# Altium schematic sheet 更新版.SchDoc
size A3
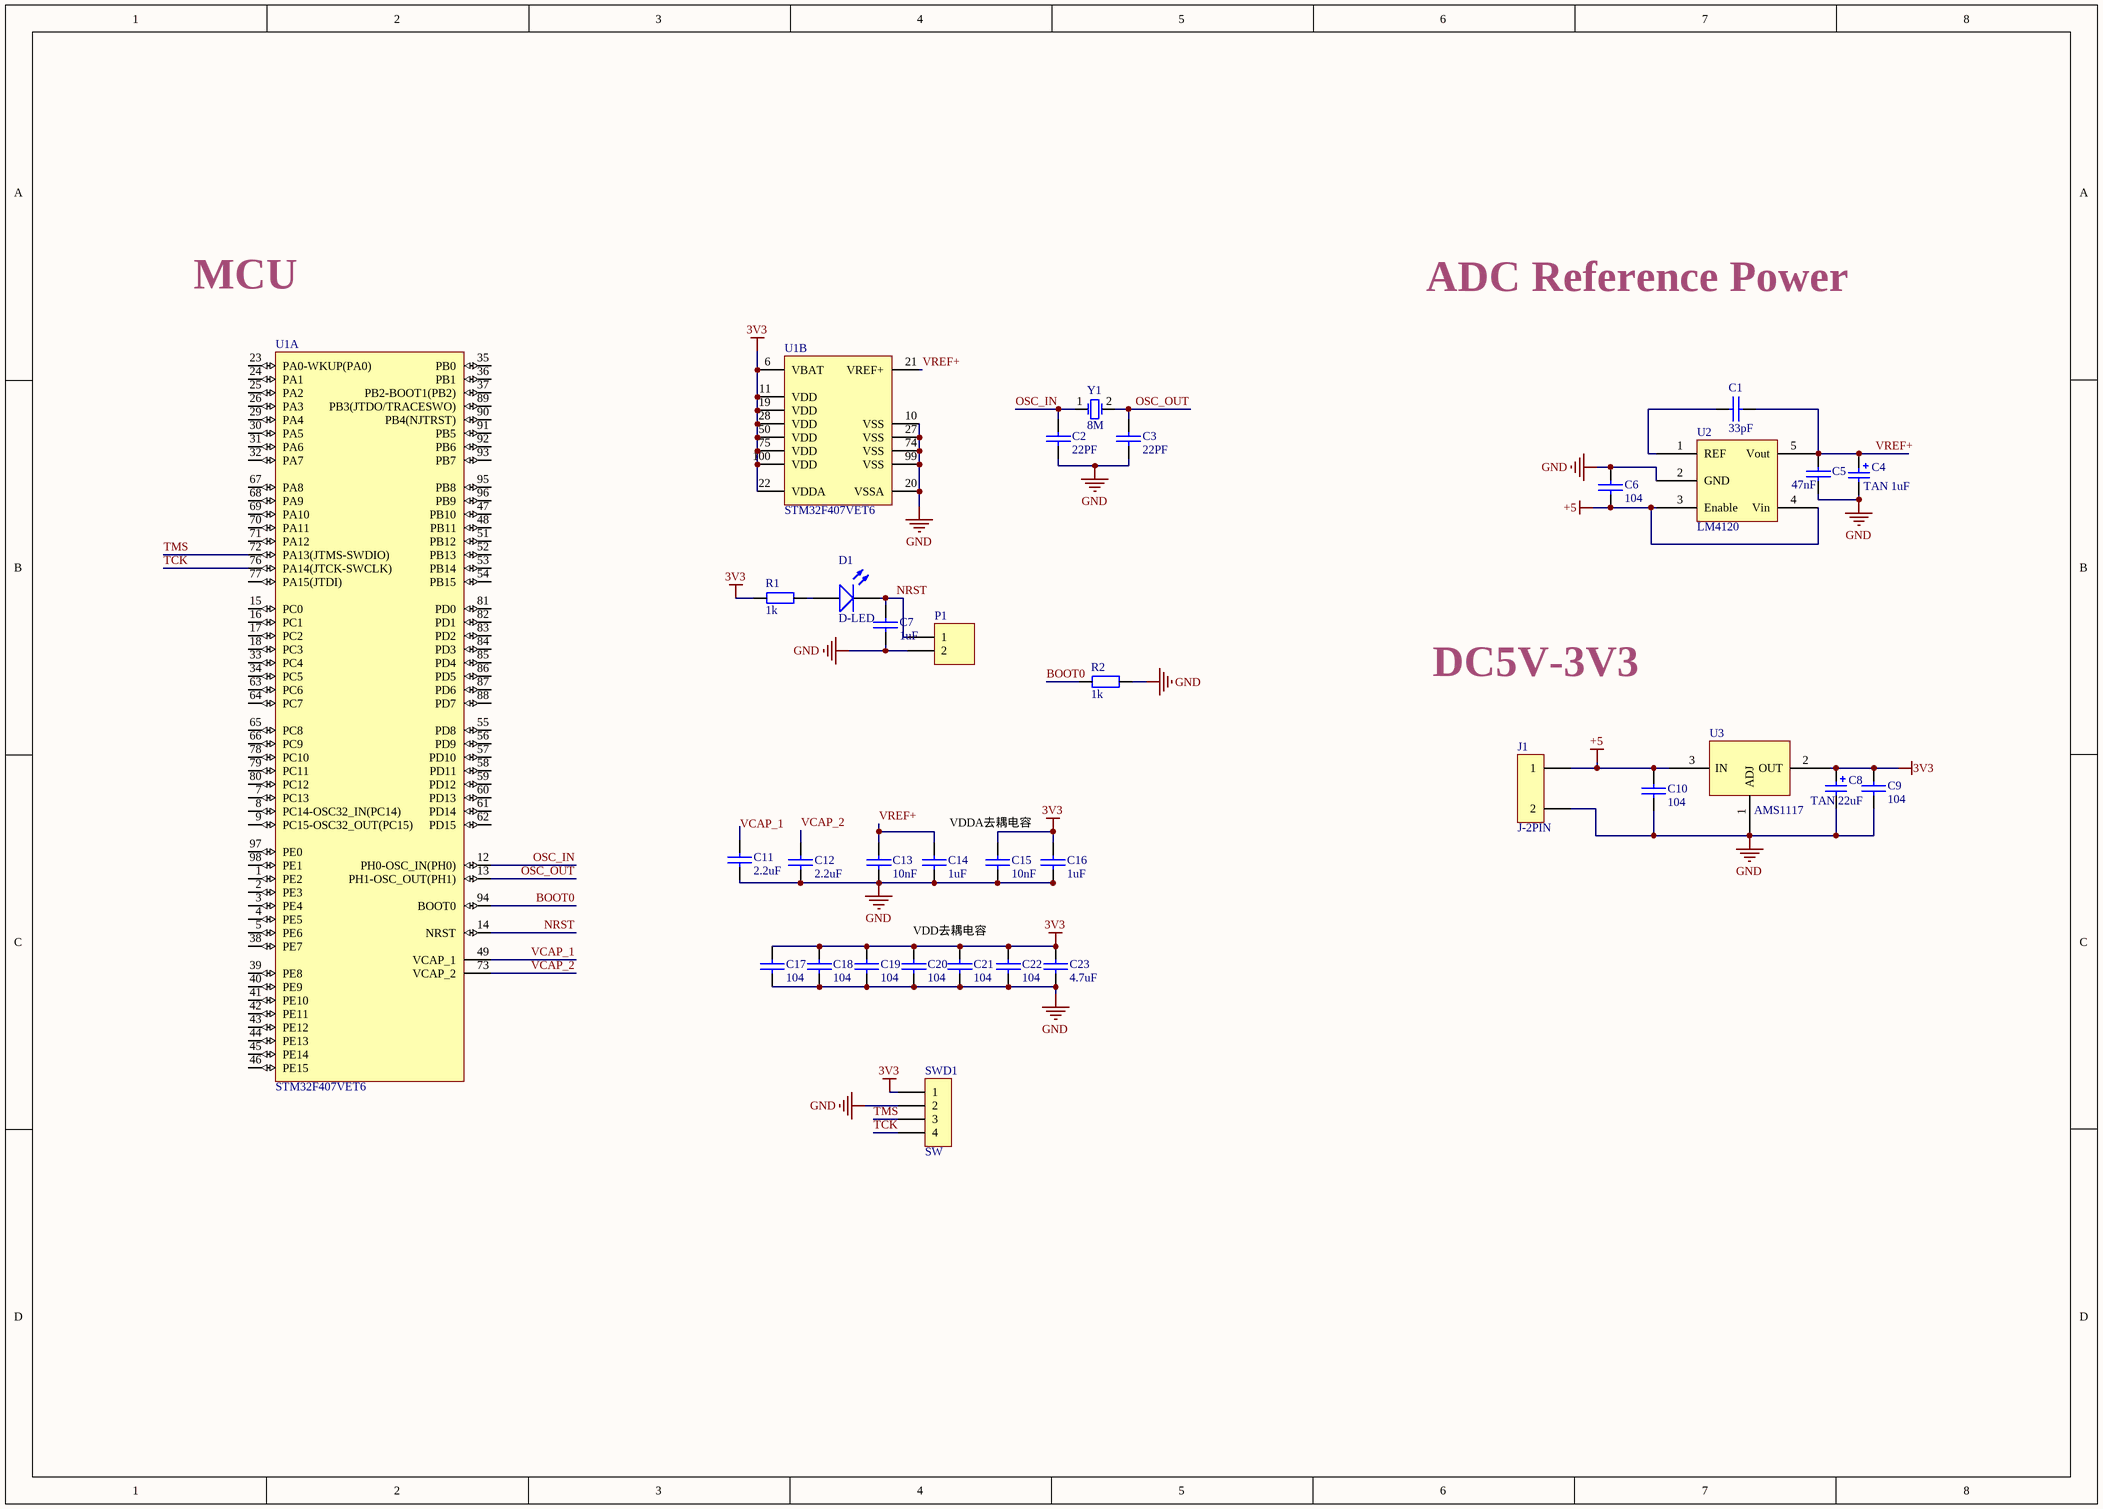
[diagram p0: 更新版.SchDoc]

## Parts
C1  33pF  [C-0603]
C2  22PF  [C-0603]
C3  22PF  [C-0603]
C4  TAN 1uF  [CAP-Ta-1206]
C5  47nF  [C-0603]
C6  104  [C-0603]
C7  1uF  [C-0603]
C8  TAN 22uF  [CAP-Ta-1206]
C9  104  [C-0603]
C10  104  [C-0603]
C11  2.2uF  [C-0603]
C12  2.2uF  [C-0603]
C13  10nF  [C-0603]
C14  1uF  [C-0603]
C15  10nF  [C-0603]
C16  1uF  [C-0603]
C17  104  [C-0603]
C18  104  [C-0603]
C19  104  [C-0603]
C20  104  [C-0603]
C21  104  [C-0603]
C22  104  [C-0603]
C23  4.7uF  [C-0603]
D1  D-LED  [D-LED-0603]
J1  J-2PIN  [J-XH-2A]
P1  (no value)  [按键两脚]
R1  1k  [R-0603]
R2  1k  [R-0603]
SWD1  SW  [J-1.27-4P]
U1  STM32F407VET6  [STM-LQFP100_M]  (parts A,B of 2)
U2  LM4120  [SOT-235]
U3  AMS1117  [SOT-223]
Y1  8M  [X-HC49S]

## Nets
3V3: C8.1 C9.1 C15.2 C16.2 C17.2 C18.2 C19.2 C20.2 C21.2 C22.2 C23.2 R1.1 SWD1.1 U1.6(VBAT) U1.11(VDD) U1.19(VDD) U1.22(VDDA) U1.28(VDD) U1.50(VDD) U1.75(VDD) U1.100(VDD) U3.2(OUT)
+5: C6.2 C10.1 J1.1 U2.3(Enable) U2.4(Vin) U3.3(IN)
GND: C2.2 C3.2 C4.2 C5.2 C6.1 C7.1 C8.2 C9.2 C10.2 C11.1 C12.1 C13.1 C14.1 C15.1 C16.1 C17.1 C18.1 C19.1 C20.1 C21.1 C22.1 C23.1 J1.2 P1.2 R2.2 SWD1.2 U1.10(VSS) U1.20(VSSA) U1.27(VSS) U1.74(VSS) U1.99(VSS) U2.2(GND) U3.1(ADJ)
BOOT0: R2.1 U1.94(BOOT0)
NRST: C7.2 D1.K P1.1 U1.14(NRST)
OSC_IN: C2.1 U1.12(PH0-OSC_IN(PH0)) Y1.1(OSC1)
OSC_OUT: C3.1 U1.13(PH1-OSC_OUT(PH1)) Y1.2(OSC2)
TCK: SWD1.4 U1.76(PA14(JTCK-SWCLK))
TMS: SWD1.3 U1.72(PA13(JTMS-SWDIO))
VCAP_1: C11.2 U1.49(VCAP_1)
VCAP_2: C12.2 U1.73(VCAP_2)
VREF+: C1.2 C4.1 C5.1 C13.2 C14.2 U1.21(VREF+) U2.5(Vout)
NetC1_1: C1.1 U2.1(REF)
NetD1_A: D1.A R1.2

Not connected (* = marked no-connect by the designer): U1 1(PE2) 2(PE3) 3(PE4) 4(PE5) 5(PE6) 7(PC13) 8(PC14-OSC32_IN(PC14)) 9(PC15-OSC32_OUT(PC15)) 15(PC0) 16(PC1) 17(PC2) 18(PC3) 23(PA0-WKUP(PA0)) 24(PA1) 25(PA2) 26(PA3) 29(PA4) 30(PA5) 31(PA6) 32(PA7) 33(PC4) 34(PC5) 35(PB0) 36(PB1) 37(PB2-BOOT1(PB2)) 38(PE7) 39(PE8) 40(PE9) 41(PE10) 42(PE11) 43(PE12) 44(PE13) 45(PE14) 46(PE15) 47(PB10) 48(PB11) 51(PB12) 52(PB13) 53(PB14) 54(PB15) 55(PD8) 56(PD9) 57(PD10) 58(PD11) 59(PD12) 60(PD13) 61(PD14) 62(PD15) 63(PC6) 64(PC7) 65(PC8) 66(PC9) 67(PA8) 68(PA9) 69(PA10) 70(PA11) 71(PA12) 77(PA15(JTDI)) 78(PC10) 79(PC11) 80(PC12) 81(PD0) 82(PD1) 83(PD2) 84(PD3) 85(PD4) 86(PD5) 87(PD6) 88(PD7) 89(PB3(JTDO/TRACESWO)) 90(PB4(NJTRST)) 91(PB5) 92(PB6) 93(PB7) 95(PB8) 96(PB9) 97(PE0) 98(PE1)

## Notes on the sheet
- MCU
- ADC Reference Power
- DC5V-3V3
- VDDA去耦电容
- VDD去耦电容

## Library data of the parts
C1-C3 C5-C7 C9-C23 = C: MLCC
C4 C8 = C-TAN: Tantalum Capacitors
D1 = D-LED: LED
P1 = Header 2: Header, 2-Pin; LatestRevisionDate: 17-Jul-2002; LatestRevisionNote: Re-released for DXP Platform.; Publisher: Altium Limited
R1 R2 = R: Resistor
SWD1 = J-4PIN: LatestRevisionDate: 17-Jul-2002; LatestRevisionNote: Re-released for DXP Platform.; Publisher: Altium Limited
U1 = STM32F407VET6: ARM Cortex-M4 32-bit MCU+FPU, 210 DMIPS, 512 kB Flash, 192 kB Internal RAM, 82 I/Os, 100-pin LQFP, -40 to 85 degC, Tray; ComponentLink1Description: Manufacturer URL; ComponentLink1URL: http://www.st.com/web/en/home.html; ComponentLink2Description: Datasheet; ComponentLink2URL: http://www.st.com/st-web-ui/static/active/en/resource/technical/document/datasheet/DM00037051.pdf; ComponentLink3Description: Package Specification; ComponentLink3URL: http://www.st.com/st-web-ui/static/active/en/resource/technical/document/data_brief/DM00071938.pdf
U2 = LM4120: 基准电压IC
U3 = AMS1117: LDO
Y1 = Crystal: Crystal Oscillator; Published: 8-Jun-2000; LatestRevisionDate: 17-Jul-2002; LatestRevisionNote: Re-released for DXP Platform.; PackageReference: R38; Publisher: Altium Limited